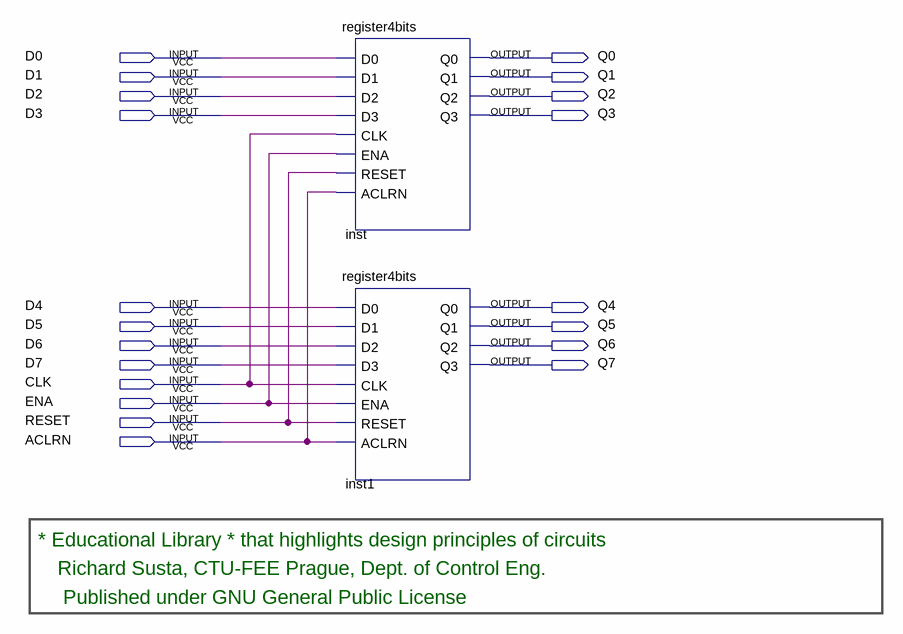
[diagram p0: schematic sheet]
// Quartus schematic register8bits.bdf as structural Verilog: 2 symbols, 20 pins
module register8bits (
  input  D0,
  input  D1,
  input  D2,
  input  D3,
  input  D4,
  input  D5,
  input  D6,
  input  D7,
  input  CLK,
  input  ENA,
  input  RESET,
  input  ACLRN,
  output Q0,
  output Q1,
  output Q2,
  output Q3,
  output Q4,
  output Q5,
  output Q6,
  output Q7
);

  register4bits inst (
    .D0(D0), .D1(D1), .D2(D2), .D3(D3), .CLK(CLK), .ENA(ENA), .RESET(RESET), .ACLRN(ACLRN), .Q0(Q0), .Q1(Q1),
    .Q2(Q2), .Q3(Q3));
  register4bits inst1 (
    .D0(D4), .D1(D5), .D2(D6), .D3(D7), .CLK(CLK), .ENA(ENA), .RESET(RESET), .ACLRN(ACLRN), .Q0(Q4), .Q1(Q5),
    .Q2(Q6), .Q3(Q7));

  // Notes on the sheet:
  //   * Educational Library * that highlights design principles of circuits
  //   Richard Susta, CTU-FEE Prague, Dept. of Control Eng. 
  //    Published under GNU General Public License
endmodule
